# Altium schematic sheet Power distribution for Noblemate Schematic Layout.SchDoc
size A4; SheetNumber: 1; SheetTotal: 1
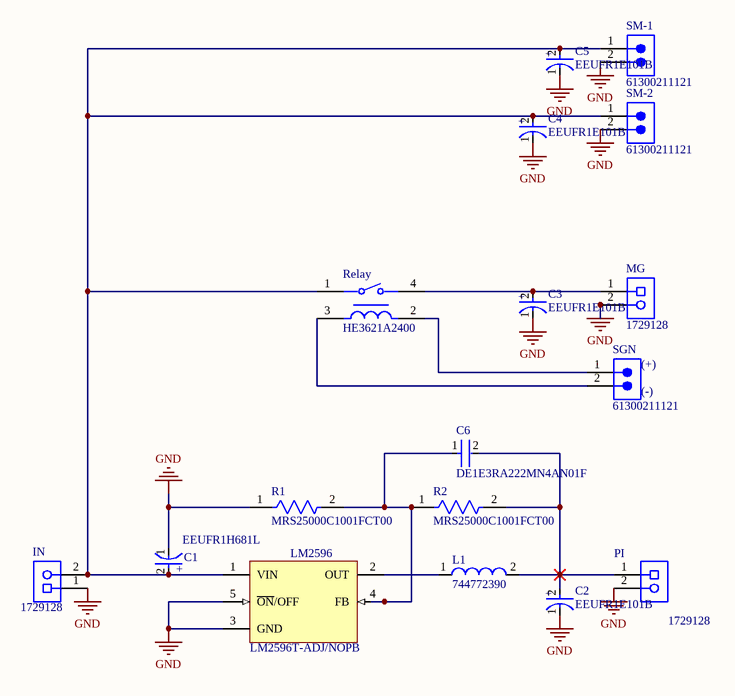
[diagram p0: Power distribution for Noblemate Schematic Layout.SchDoc]

## Parts
C1  EEUFR1H681L  [FP-RAD-TH-D_12_5_0_5-L_30-MFG]
C2  EEUFR1E101B  [FP-RAD-TH-D_6_3_0_5-L_11-MFG]
C3  EEUFR1E101B  [FP-RAD-TH-D_6_3_0_5-L_11-MFG]
C4  EEUFR1E101B  [FP-RAD-TH-D_6_3_0_5-L_11-MFG]
C5  EEUFR1E101B  [FP-RAD-TH-D_6_3_0_5-L_11-MFG]
C6  DE1E3RA222MN4AN01F  [FP-DE1_D9_T4_F10_d0_6-0_0-MFG]
IN  1729128  [PHOE-1729128-2_V]
L1  744772390  [WE-TI-L]
LM2596  LM2596T-ADJ/NOPB  [NDH0005A]
MG  1729128  [PHOE-1729128-2_V]
PI  1729128  [PHOE-1729128-2_V]
R1  MRS25000C1001FCT00  [FP-MRS25-MFG]
R2  MRS25000C1001FCT00  [FP-MRS25-MFG]
Relay  HE3621A2400  [FP-HE3621A2400-MFG]
SGN  61300211121  [61300211121]
SM-1  61300211121  [61300211121]
SM-2  61300211121  [61300211121]

## Nets
GND: C1.1(C) C2.1(C) C3.1(C) C4.1(C) C5.1(C) IN.1 LM2596.3(GND) LM2596.5(~{ON}/OFF) MG.2 PI.2 R1.1 SM-1.2 SM-2.2
NetC1_2: C1.2(A) C4.2(A) C5.2(A) IN.2 LM2596.1(VIN) Relay.1 SM-1.1 SM-2.1
NetC2_2: C2.2(A) C6.2 L1.2 PI.1 R2.2
NetC3_2: C3.2(A) MG.1 Relay.4
NetC6_1: C6.1 LM2596.4(FB) R1.2 R2.1
NetL1_1: L1.1 LM2596.2(OUT)
NetRelay_2: Relay.2 SGN.1
NetRelay_3: Relay.3 SGN.2

## Notes on the sheet
- (near SGN) (+)
- (near SGN) (-)
- (in symbol CMP-05427-000465-1) +
- (in symbol CMP-05427-000897-1) +

## Library data of the parts
C1 = CMP-05427-000465-1: Aluminum Electrolytic Capacitors (Radial Lead Type) 680uF ±20% 50V
C2-C5 = CMP-05427-000897-1: Aluminum Electrolytic Capacitors (Radial Lead Type) 100uF ±20% 25V; ESR (Equivalent Series Resistance): 130mR; Ripple Current: 455mA; Polarity: Polar; Life (Hours): 2000Hour; Lead Diameter: 0.5mm; Tolerance: 20%; Radiation Hardening: No; Min Operating Temperature: -40°C; Series: FR; Max Operating Temperature: 105°C; Lead Free: Lead Free; Package Quantity: 2000; Capacitance: 100uF; Lead Pitch: 5mm; Voltage Rating (DC): 25V; Length: 11.2mm; Features: General Purpose; Mount: Through Hole; Voltage Rating: 25V; Case/Package: Radial; Impedance: 130mR; RoHS Compliant: Yes; Packaging: Tape and Reel; Height - Seated (Max): 0.441inch; Height: 11.2mm; Diameter: 6.3mm; Termination: Radial
C6 = CMP-06035-032365-1: Cap Ceramic Disc 2200pF 20% 250VAC Thru-Hole 9.0x4.0x10.0 Ammo pack; Lead/Base Style: Straight; Voltage Rating: 250V; Ratings: X1; Capacitance: 2.2nF; Case/Package: Radial; Packaging: Cut Tape; Max Operating Temperature: 125°C; Tolerance: 20%; Mount: Through Hole; Min Operating Temperature: -40°C
IN MG PI = CMP-2000-05815-1: PCB Terminal Block, 13.5 A, 400 V, 2-Pin THD, RoHS, Bulk; Manufacturer: Phoenix Contact; Package Version: 03/2015; No. of Rows: 1; Pitch: 5.08mm; No. of Positions: 2; Voltage Rating: 400V; Current Rating: 13500mA; Manufacturer URL: http://www.phoenixcontact.com/; Datasheet URL: https://datasheet.ciiva.com/16046/1729128-16046181.pdf; RoHS: TRUE; Package URL: https://www.phoenixcontact.com/online/portal/pi/pxc/product_detail_page/!ut/p/b1/3VdJjqNKFDxLH8AFycySyWY2ozFsEPOMMQaDOX1XedGL_1Vdm5YXJleknhSKeBkvI6EA8ncAo3AYoDhBQGco6KN7VURTdemj9us_IEKEZo_YHiPAEWEFmDGOHMORkqKYCORBZxgL7ZoaZYcbFFUZ3fqxSY6GOuxydWUuHqz1ynmMFygu583Bob0Ewr6Sd_l-5m-kAueHiB0jpRwZwe58wwtkpxtMYd_LmGcDRU02dRNEyWt6Y2ti5pSyJ_reIkzIulrqApdnbT11V5jnCKbYNCvhEM1MCpPByat_X379-iThf08CI5GfOPqfBeS3BRoBOdD55AKVv0iLwCMq-2BrzXWSGRH7pUGD9uwXQjiph3xL0DKQwdGa0JImiIOmBNOestqgwTHSSs2oOep-78apyXQBvNi8ZLaFjvjWvcaUEBu0MC6Wbe-d6mB0FAebo2lUWinqYaZs5DAYzV0RP9yitUjnGJ0iI9xhZkT42OCQNUJJhkgWINNQLP2JFP6OpMg3JCVg70jqHT0lvKOnhHf0lPuOnnLf0VPuWx6_dxwUIvwk5WMkT0kLL1mh61l2yZVSzG3pYV_bqo-mj6uMKwKwdnnW8Jh5RTOJzMOA5c-eJDaZQw4mTMPH02PvS_ZAqNVjVTo2WyYLkwH_KU1mmmG5kjRhDqPXLwwVHvVOjCM60-fpXvTDfMGW1PVFVS1r4e4yVDk4ZdNbkUHvqPqQSeian4UD39fNKmachqdJ1NJbyk8rXT9mXTvPk3oE5meulKGgiruPJek-4I9hTT6G8ZLOyRSm2RRVbThERQad5OS28hdt4YW4vG0stgYYzsWsK4_7y6DZMjJSCqri1kyiZR5vD7pwIrNR7QwPHTcLTI5qT7eRlpHrdGiupYlqQDJ7zy_CND8fWWBoLRXxk1RVcXiBQwbTD4Xi7KL-FuO94t9xaqweXzH; PartNumber: 1729128; Package Description: 2-Pin Through Hole Device, Body 8.1 x 10.16 mm, Pitch 5.08 mm; Datasheet Version: 12/2013; Mounting Technology: ThroughHole; Orientation: Horizontal; Package Reference: 1729128-2; Packing: Bulk
L1 = CMP-0225-00043-1: Radial Leaded Wire Wound Inductor WE-TI, L = 39.0 µH; Inductance: 39.0 ÂµH; ComponentLink1Description: Manufacturer Link; ComponentLink1URL: http://www.we-online.com; PackageDescription: THT Inductor, 2-Leads, Body 7.8 x 7.8 mm; DatasheetVersion: ver 8, Oct-2009; ComponentLink2URL: http://www.we-online.de/katalog/media/pdf/744772390.pdf; PackageReference: WE-TI-L; PackageVersion: 2006; ComponentLink2Description: Datasheet
LM2596 = CMP-0069-01928-3: SIMPLE SWITCHER® Power Converter 150 KHz 3A Step-Down Voltage Regulator, 5-pin TO-220, Pb-Free; Manufacturer: Texas Instruments; PowerWise: N; PackageTopMarking: NSUZXYTTE#*LM2596T*-ADJ P+; ComponentLink1Description: Datasheet URL; PackageDescription: TO-220, Molded, Stagger Bend, 5 Lead; PackageReference: NDH0005A; PinCount: 5; ComponentLink1URL: http://www.ti.com/general/docs/lit/getliterature.tsp?genericPartNumber=LM2596&fileType=pdf; CompType: Switcher; RoHS: Y
R1 R2 = CMP-02408-000051-1: RES 1K OHM 0.6W 1% AXIAL; Power Rating: 600mW; Lead Diameter: 0.6mm; Voltage Rating (DC): 350V; Resistance: 1kR; Temperature Coefficient: 50ppm/°C; Width: 2.5mm; Military Standard: Not; Package Quantity: 5000; Radiation Hardening: No; Case/Package: Axial; Resistance Tolerance: 1%; Resistor Type: Metal Film; Contact Plating: Tin; Length: 6.5mm; Lead Free: Lead Free; RoHS Compliant: Yes; Mount: Through Hole; Number of Pins: 2; Technology: THIN FILM; Voltage Rating: 350V; Min Operating Temperature: -55°C; Weight: 0.00776oz; Diameter: 2.5mm; Construction: Cylindrical; Series: MRS25; Tolerance: 1%; Packaging: Tape and Reel; Max Operating Temperature: 155°C; Max Power Dissipation: 600mW; Number of Terminations: 2; Termination: Axial
Relay = CMP-08622-000010-1: RELAY REED SPST 500MA 24V; Coil Type: Non-Latching; Coil Resistance: 2.15kR; Voltage Rating (DC): 200V; Switching Capacity: 10W; Release Time: 1ms; Coil Current: 11.1mA; Ratings: IP67; Height: 7.87mm; Package Quantity: 25; Packaging: Bulk; Series: HE3600; Depth: 5.08mm; Length: 19.05mm; Width: 5.65mm; Contact Current Rating: 500mA; Case/Package: SIP; Switching Current: 500mA; Lead Free: Lead Free; REACH SVHC: No SVHC; Termination: PC Pin; Mount: Through Hole; Throw Configuration: SPST; RoHS Compliant: Yes; Max Operating Temperature: 85°C; Operate Time: 1ms; Number of Pins: 4; Min Operating Temperature: -40°C; Relay Type: Reed; Coil Voltage (DC): 24V; Radiation Hardening: No
SGN SM-1 SM-2 = CMP-1712-00002-6: NexarPartId: 20081794; Number of Contacts: 2; Pitch: 2.54mm; Connector Type: Male Pin; Voltage Rating: 250V; Current Rating: 3A; Gender: Male; Contact Resistance: 20mΩ; Height: 8.94mm; Lead Free: Lead Free; Number of Pins: 2; Termination: Through Hole; RoHS: Compliant; Lead Pitch: 2.54mm; REACH SVHC: No SVHC; Housing Material: PBT; Contact Mating Length: 5.9944mm; Min Operating Temperature: -40°C; Orientation: Vertical; Contact Material: Copper; Contact Gender: Male; Max Operating Temperature: 125°C; Number of Rows: 1; Number of Positions: 2; Packaging: Bulk; Contact Plating: Gold; Mount: Through Hole; Color: Black; Operating Supply Voltage: 250V